# Altium schematic sheet Power Outputs.SchDoc
size A; SheetNumber: 4; SheetTotal: 4
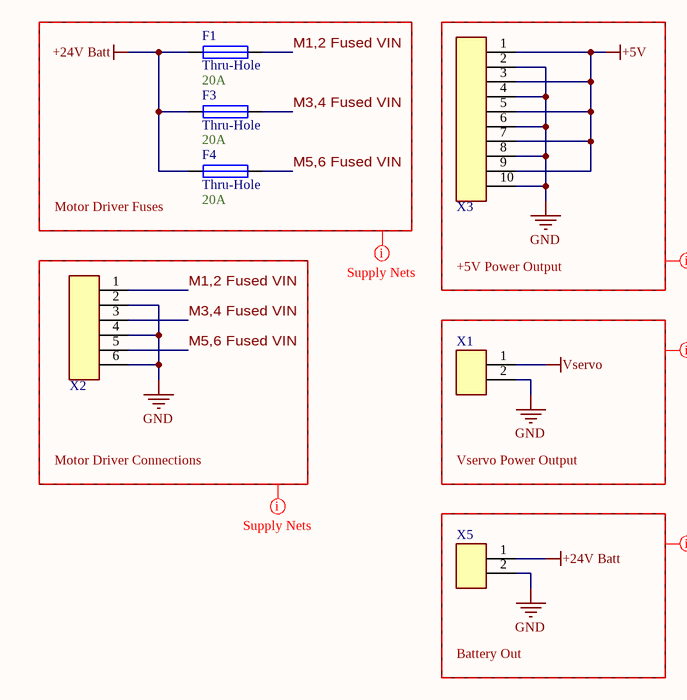
[diagram p0: Power Outputs.SchDoc]

## Parts
F1  Thru-Hole  Capacity: 20A  [[Fuse] Thru-Hole Blade]
F3  Thru-Hole  Capacity: 20A  [[Fuse] Thru-Hole Blade]
F4  Thru-Hole  Capacity: 20A  [[Fuse] Thru-Hole Blade]
X1  2pin Screw Terminal  [[Screw Terminal] 2pin 5mm]  (value not drawn)
X2  [Screw Terminal] 6pin  [[Screw Terminal] 6pin]  (value not drawn)
X3  [Screw Terminal] 10pin  [[Screw Terminal] 10pin]  (value not drawn)
X5  2pin Screw Terminal  [[Screw Terminal] 2pin 5mm]  (value not drawn)

## Blocks framed on the sheet
Motor Driver Fuses: F1 F3 F4
+5V Power Output: X3
Motor Driver Connections: X2
Vservo Power Output: X1
Battery Out: X5

## Nets
+5V: X3.1 X3.3 X3.5 X3.7 X3.9
+24V Batt: F1.1 F3.1 F4.1 X5.1
GND: X1.2 X2.2 X2.4 X2.6 X3.2 X3.4 X3.6 X3.8 X3.10 X5.2
Vservo: X1.1
M1,2 Fused VIN: F1.2 X2.1
M3,4 Fused VIN: F3.2 X2.3
M5,6 Fused VIN: F4.2 X2.5

## Layout directives
net class Supply_Nets: +5V, +24V Batt, GND, M1,2 Fused VIN, M3,4 Fused VIN, M5,6 Fused VIN, Vservo

## Library data of the parts
F1 F3 F4 = [Fuse] Thru-Hole Blade: Mouser Part #: *; Supplier 1: DigiKey; Supplier Part Number 1: WK6265-ND
X1 X5 = [Screw Terminal] 2pin: Supplier 1: DigiKey; Supplier Part Number 1: 102-6145-ND
X2 = [Screw Terminal] 6pin: x3; Supplier 1: DigiKey; Supplier Part Number 1: 102-6145-ND
X3 = [Screw Terminal] 10pin: x5; Supplier 1: DigiKey; Supplier Part Number 1: 102-6145-ND